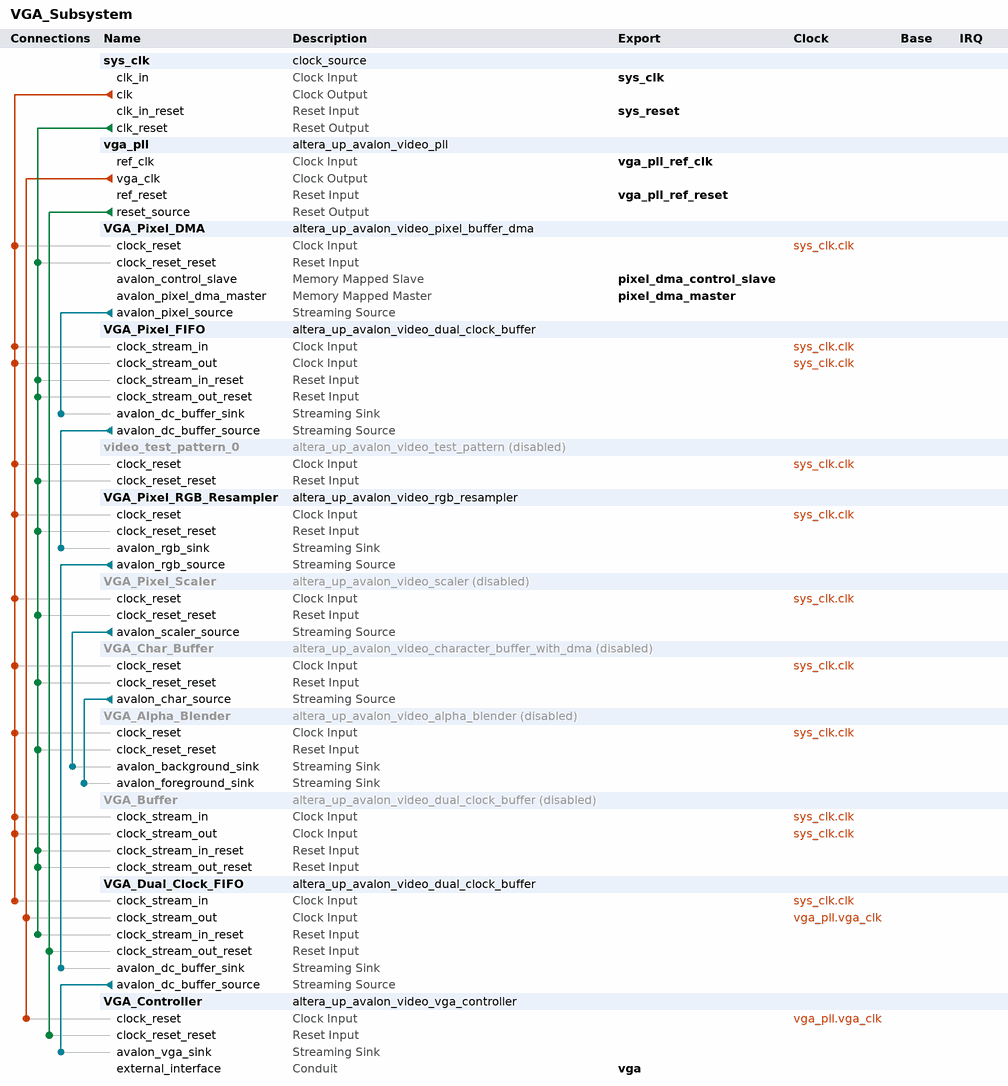
[diagram p0: system contents]
# Platform Designer (Qsys) system VGA_Subsystem, Cyclone V 5CSEMA5F31C6
# Parameters at their usual value, and those the tool derives, are not listed.
package require -exact qsys 13.0
create_system VGA_Subsystem
set_project_property DEVICE_FAMILY {Cyclone V}
set_project_property DEVICE 5CSEMA5F31C6

add_instance sys_clk clock_source 13.1
set_instance_parameter_value sys_clk clockFrequency 100000000
set_instance_parameter_value sys_clk clockFrequencyKnown false

add_instance vga_pll altera_up_avalon_video_pll 13.1
set_instance_parameter_value vga_pll gui_refclk 50.0
set_instance_parameter_value vga_pll camera {5MP Digital Camera}
set_instance_parameter_value vga_pll gui_resolution {XGA 1024x768}
set_instance_parameter_value vga_pll lcd {7" LCD on VEEK-MT and MTL Module}

add_instance VGA_Pixel_DMA altera_up_avalon_video_pixel_buffer_dma 13.0
set_instance_parameter_value VGA_Pixel_DMA addr_mode X-Y
set_instance_parameter_value VGA_Pixel_DMA start_address 0
set_instance_parameter_value VGA_Pixel_DMA back_start_address 0
set_instance_parameter_value VGA_Pixel_DMA image_width 1024
set_instance_parameter_value VGA_Pixel_DMA image_height 768
set_instance_parameter_value VGA_Pixel_DMA color_space {16-bit RGB}

add_instance VGA_Pixel_FIFO altera_up_avalon_video_dual_clock_buffer 13.0
set_instance_parameter_value VGA_Pixel_FIFO color_bits 16
set_instance_parameter_value VGA_Pixel_FIFO color_planes 1

add_instance video_test_pattern_0 altera_up_avalon_video_test_pattern 13.0
set_instance_property video_test_pattern_0 ENABLED false
set_instance_parameter_value video_test_pattern_0 width 1024
set_instance_parameter_value video_test_pattern_0 height 768

add_instance VGA_Pixel_RGB_Resampler altera_up_avalon_video_rgb_resampler 13.0
set_instance_parameter_value VGA_Pixel_RGB_Resampler input_type {16-bit RGB}
set_instance_parameter_value VGA_Pixel_RGB_Resampler output_type {30-bit RGB}
set_instance_parameter_value VGA_Pixel_RGB_Resampler alpha 1023

add_instance VGA_Pixel_Scaler altera_up_avalon_video_scaler 13.0
set_instance_property VGA_Pixel_Scaler ENABLED false
set_instance_parameter_value VGA_Pixel_Scaler width_scaling 2
set_instance_parameter_value VGA_Pixel_Scaler height_scaling 2
set_instance_parameter_value VGA_Pixel_Scaler width_in 512
set_instance_parameter_value VGA_Pixel_Scaler height_in 384
set_instance_parameter_value VGA_Pixel_Scaler color_bits 10
set_instance_parameter_value VGA_Pixel_Scaler color_planes 3

add_instance VGA_Char_Buffer altera_up_avalon_video_character_buffer_with_dma 13.0
set_instance_property VGA_Char_Buffer ENABLED false
set_instance_parameter_value VGA_Char_Buffer enable_transparency true

add_instance VGA_Alpha_Blender altera_up_avalon_video_alpha_blender 13.0
set_instance_property VGA_Alpha_Blender ENABLED false

add_instance VGA_Buffer altera_up_avalon_video_dual_clock_buffer 13.0
set_instance_property VGA_Buffer ENABLED false
set_instance_parameter_value VGA_Buffer color_bits 10

add_instance VGA_Dual_Clock_FIFO altera_up_avalon_video_dual_clock_buffer 13.0
set_instance_parameter_value VGA_Dual_Clock_FIFO color_bits 10

add_instance VGA_Controller altera_up_avalon_video_vga_controller 13.0
set_instance_parameter_value VGA_Controller board DE1-SoC
set_instance_parameter_value VGA_Controller resolution {XGA 1024x768}

# connections
add_connection sys_clk.clk VGA_Alpha_Blender.clock_reset clock
add_connection sys_clk.clk VGA_Buffer.clock_stream_in clock
add_connection sys_clk.clk VGA_Buffer.clock_stream_out clock
add_connection sys_clk.clk VGA_Char_Buffer.clock_reset clock
add_connection sys_clk.clk VGA_Dual_Clock_FIFO.clock_stream_in clock
add_connection sys_clk.clk VGA_Pixel_DMA.clock_reset clock
add_connection sys_clk.clk VGA_Pixel_FIFO.clock_stream_in clock
add_connection sys_clk.clk VGA_Pixel_FIFO.clock_stream_out clock
add_connection sys_clk.clk VGA_Pixel_RGB_Resampler.clock_reset clock
add_connection sys_clk.clk VGA_Pixel_Scaler.clock_reset clock
add_connection sys_clk.clk video_test_pattern_0.clock_reset clock
add_connection vga_pll.vga_clk VGA_Controller.clock_reset clock
add_connection vga_pll.vga_clk VGA_Dual_Clock_FIFO.clock_stream_out clock
add_connection sys_clk.clk_reset VGA_Alpha_Blender.clock_reset_reset reset
add_connection sys_clk.clk_reset VGA_Buffer.clock_stream_in_reset reset
add_connection sys_clk.clk_reset VGA_Buffer.clock_stream_out_reset reset
add_connection sys_clk.clk_reset VGA_Char_Buffer.clock_reset_reset reset
add_connection sys_clk.clk_reset VGA_Dual_Clock_FIFO.clock_stream_in_reset reset
add_connection sys_clk.clk_reset VGA_Pixel_DMA.clock_reset_reset reset
add_connection sys_clk.clk_reset VGA_Pixel_FIFO.clock_stream_in_reset reset
add_connection sys_clk.clk_reset VGA_Pixel_FIFO.clock_stream_out_reset reset
add_connection sys_clk.clk_reset VGA_Pixel_RGB_Resampler.clock_reset_reset reset
add_connection sys_clk.clk_reset VGA_Pixel_Scaler.clock_reset_reset reset
add_connection sys_clk.clk_reset video_test_pattern_0.clock_reset_reset reset
add_connection vga_pll.reset_source VGA_Controller.clock_reset_reset reset
add_connection vga_pll.reset_source VGA_Dual_Clock_FIFO.clock_stream_out_reset reset
add_connection VGA_Char_Buffer.avalon_char_source VGA_Alpha_Blender.avalon_foreground_sink avalon_streaming
add_connection VGA_Dual_Clock_FIFO.avalon_dc_buffer_source VGA_Controller.avalon_vga_sink avalon_streaming
add_connection VGA_Pixel_DMA.avalon_pixel_source VGA_Pixel_FIFO.avalon_dc_buffer_sink avalon_streaming
add_connection VGA_Pixel_FIFO.avalon_dc_buffer_source VGA_Pixel_RGB_Resampler.avalon_rgb_sink avalon_streaming
add_connection VGA_Pixel_RGB_Resampler.avalon_rgb_source VGA_Dual_Clock_FIFO.avalon_dc_buffer_sink avalon_streaming
add_connection VGA_Pixel_Scaler.avalon_scaler_source VGA_Alpha_Blender.avalon_background_sink avalon_streaming

# exported interfaces
add_interface sys_clk clock sink
set_interface_property sys_clk EXPORT_OF sys_clk.clk_in
add_interface sys_reset reset sink
set_interface_property sys_reset EXPORT_OF sys_clk.clk_in_reset
add_interface vga conduit end
set_interface_property vga EXPORT_OF VGA_Controller.external_interface
add_interface pixel_dma_master avalon master
set_interface_property pixel_dma_master EXPORT_OF VGA_Pixel_DMA.avalon_pixel_dma_master
add_interface pixel_dma_control_slave avalon slave
set_interface_property pixel_dma_control_slave EXPORT_OF VGA_Pixel_DMA.avalon_control_slave
add_interface vga_pll_ref_clk clock sink
set_interface_property vga_pll_ref_clk EXPORT_OF vga_pll.ref_clk
add_interface vga_pll_ref_reset reset sink
set_interface_property vga_pll_ref_reset EXPORT_OF vga_pll.ref_reset

set_interconnect_requirement {$system} qsys_mm.clockCrossingAdapter HANDSHAKE
set_interconnect_requirement {$system} qsys_mm.maxAdditionalLatency 1
set_interconnect_requirement {$system} qsys_mm.insertDefaultSlave false

save_system VGA_Subsystem.qsys
